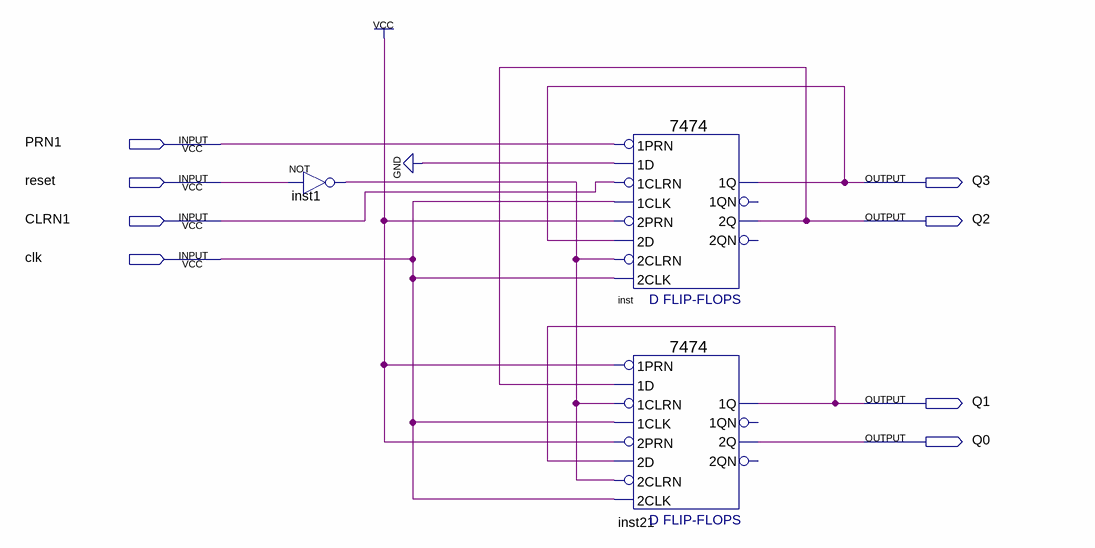
[diagram p0: schematic sheet]
// Quartus schematic Counter.bdf as structural Verilog: 3 symbols, 8 pins
module Counter (
  input  PRN1,
  input  reset,
  input  CLRN1,
  input  clk,
  output Q3,
  output Q2,
  output Q1,
  output Q0
);

  wire inst1_out;

  not inst1 (inst1_out, reset);
  \7474  inst (
    .\2D (Q3), .\2PRN (1'b1), .\1CLK (clk), .\1D (1'b0), .\1PRN (PRN1), .\2CLK (clk), .\2CLRN (inst1_out),
    .\1CLRN (CLRN1), .\2Q (Q2), .\1Q (Q3));  // open: 1QN, 2QN
  \7474  inst21 (
    .\2D (Q1), .\2PRN (1'b1), .\1CLK (clk), .\1D (Q2), .\1PRN (1'b1), .\2CLK (clk), .\2CLRN (inst1_out),
    .\1CLRN (inst1_out), .\2Q (Q0), .\1Q (Q1));  // open: 1QN, 2QN
endmodule
